# EAGLE design LM13700 (EAGLE 9.3.2)
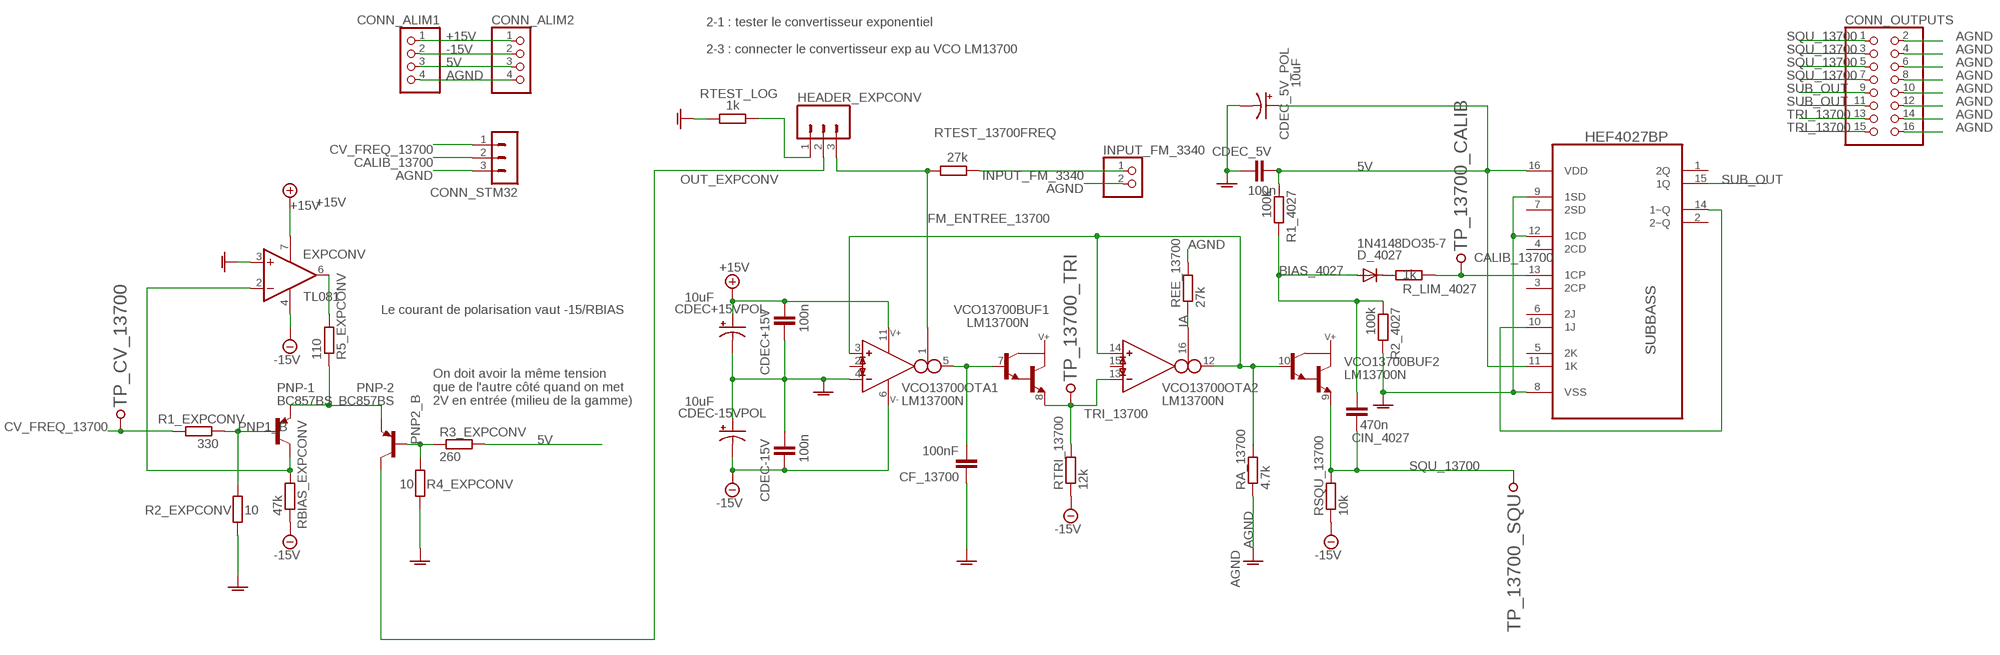
[diagram p0: schematic, sheet 1]

## Parts
CDEC+15V  100n  C-EU025-024X044  [C025-024X044]
CDEC+15VPOL  10uF  10UF-POLAR-RADIAL-2.5MM-KIT-25V-20%  [CPOL-RADIAL-2.5MM-5MM-KIT]
CDEC-15V  100n  C-EU025-024X044  [C025-024X044]
CDEC-15VPOL  10uF  10UF-POLAR-RADIAL-2.5MM-KIT-25V-20%  [CPOL-RADIAL-2.5MM-5MM-KIT]
CDEC_5V  100n  C-EU025-024X044  [C025-024X044]
CDEC_5V_POL  10uF  10UF-POLAR-RADIAL-2.5MM-KIT-25V-20%  [CPOL-RADIAL-2.5MM-5MM-KIT]
CF_13700  100nF  C-EU025-024X044  [C025-024X044]
CIN_4027  470n  C-EU050-024X044  [C050-024X044]
CONN_ALIM1  PINHD-1X4  [1X04]
CONN_ALIM2  PINHD-1X4  [1X04]
CONN_OUTPUTS  PINHD-2X8  [2X08]
CONN_STM32  MA03-1  [MA03-1]
D_4027  1N4148DO35-7  [DO35-7]
EXPCONV  TL081  1AMP_P7+4N  [DIL08]
HEADER_EXPCONV  M03  [03P]
INPUT_FM_3340  PINHD-1X2  [1X02]
PNP  BC857BS  [SOT363]
R1_4027  100k  R-EU_0204/5  [0204/5]
R1_EXPCONV  330  R-EU_0204/5  [0204/5]
R2_4027  100k  R-EU_0204/5  [0204/5]
R2_EXPCONV  10  R-EU_0204/5  [0204/5]
R3_EXPCONV  260  R-EU_0204/5  [0204/5]
R4_EXPCONV  10  R-EU_0204/5  [0204/5]
R5_EXPCONV  110  R-EU_0204/5  [0204/5]
R_LIM_4027  1k  R-EU_0204/5  [0204/5]
RA_13700  4.7k  R-EU_0204/5  [0204/5]
RBIAS_EXPCONV  47k  R-EU_0204/5  [0204/5]
REE_13700  27k  R-EU_0204/5  [0204/5]
RSQU_13700  10k  R-EU_0204/5  [0204/5]
RTEST_13700FREQ  27k  R-EU_0204/5  [0204/5]
RTEST_LOG  1k  R-EU_0204/5  [0204/5]
RTRI_13700  12k  R-EU_0204/5  [0204/5]
SUBBASS  HEF4027BP  [DIP254P762X420-16]
TP_13700_CALIB  TESTPOINT  [TESTPOINT_63]
TP_13700_SQU  TESTPOINT  [TESTPOINT_63]
TP_13700_TRI  TESTPOINT  [TESTPOINT_63]
TP_CV_13700  TESTPOINT  [TESTPOINT_63]
VCO13700  LM13700N  [DIL16]

## Nets
5V: CDEC_5V.1 CDEC_5V_POL.1(+) CONN_ALIM1.3 CONN_ALIM2.3 R1_4027.1 R3_EXPCONV.2 SUBBASS.11(1K) SUBBASS.16(VDD)
+15V: CDEC+15V.1 CDEC+15VPOL.1(+) CONN_ALIM1.1 CONN_ALIM2.1 EXPCONV.7(V+) VCO13700.11(SUPPLY:V+)
-15V: CDEC-15V.2 CDEC-15VPOL.2(-) CONN_ALIM1.2 CONN_ALIM2.2 EXPCONV.4(V-) RBIAS_EXPCONV.1 RSQU_13700.1 RTRI_13700.1 VCO13700.6(SUPPLY:V-)
AGND: CDEC+15V.2 CDEC+15VPOL.2(-) CDEC-15V.1 CDEC-15VPOL.1(+) CDEC_5V.2 CDEC_5V_POL.2(-) CF_13700.1 CONN_ALIM1.4 CONN_ALIM2.4 CONN_OUTPUTS.2 CONN_OUTPUTS.4 CONN_OUTPUTS.6 CONN_OUTPUTS.8 CONN_OUTPUTS.10 CONN_OUTPUTS.12 CONN_OUTPUTS.14 CONN_OUTPUTS.16 CONN_STM32.3 EXPCONV.3(+IN) INPUT_FM_3340.2 R2_4027.2 R2_EXPCONV.2 R4_EXPCONV.2 RA_13700.1 REE_13700.2 RTEST_LOG.2 SUBBASS.8(VSS) SUBBASS.9(1SD) SUBBASS.12(1CD) VCO13700.4(OTA1:IN_N)
BIAS_4027: CIN_4027.1 D_4027.A R1_4027.2 R2_4027.1
CALIB_13700: CONN_STM32.2 R_LIM_4027.1 SUBBASS.13(1CP) TP_13700_CALIB.P$1
CV_FREQ_13700: CONN_STM32.1 R1_EXPCONV.2 TP_CV_13700.P$1
FM_ENTREE_13700: HEADER_EXPCONV.3 RTEST_13700FREQ.2 VCO13700.1(OTA1:I_BIAS)
IA: REE_13700.1 VCO13700.16(OTA2:I_BIAS)
INPUT_FM_3340: INPUT_FM_3340.1 RTEST_13700FREQ.1
N$3: SUBBASS.10(1J) SUBBASS.14(1~Q)
N$47: D_4027.C R_LIM_4027.2
N$52: EXPCONV.6(OUT) R5_EXPCONV.2
N$63: RA_13700.2 VCO13700.3(OTA1:IN_P) VCO13700.10(BUF2:B) VCO13700.12(OTA2:OUT) VCO13700.14(OTA2:IN_P)
N$64: CF_13700.2 VCO13700.5(OTA1:OUT) VCO13700.7(BUF1:B)
N$94: HEADER_EXPCONV.1 RTEST_LOG.1
OUT_EXPCONV: HEADER_EXPCONV.2 PNP.3(-2:C)
PNP1_B: PNP.2(-1:B) R1_EXPCONV.1 R2_EXPCONV.1
PNP1_C: EXPCONV.2(-IN) PNP.6(-1:C) RBIAS_EXPCONV.2
PNP2_B: PNP.5(-2:B) R3_EXPCONV.1 R4_EXPCONV.1
PNP_E: PNP.1(-1:E) PNP.4(-2:E) R5_EXPCONV.1
SQU_13700: CIN_4027.2 CONN_OUTPUTS.1 CONN_OUTPUTS.3 CONN_OUTPUTS.5 CONN_OUTPUTS.7 RSQU_13700.2 TP_13700_SQU.P$1 VCO13700.9(BUF2:E)
SUB_OUT: CONN_OUTPUTS.9 CONN_OUTPUTS.11 SUBBASS.15(1Q)
TRI_13700: CONN_OUTPUTS.13 CONN_OUTPUTS.15 RTRI_13700.2 TP_13700_TRI.P$1 VCO13700.8(BUF1:E) VCO13700.13(OTA2:IN_N)
Unconnected: SUBBASS.1(2Q) SUBBASS.2(2~Q) SUBBASS.3(2CP) SUBBASS.4(2CD) SUBBASS.5(2K) SUBBASS.6(2J) SUBBASS.7(2SD) VCO13700.2(OTA1:I_DIODE) VCO13700.15(OTA2:I_DIODE)

## Notes on the sheet
- 2-1 : tester le convertisseur exponentiel
  
  2-3 : connecter le convertisseur exp au VCO LM13700
- Le courant de polarisation vaut -15/RBIAS
- On doit avoir la même tension 
  que de l'autre côté quand on met
  2V en entrée (milieu de la gamme)

## Library data of the parts
CDEC+15V CDEC-15V CDEC_5V CF_13700 CIN_4027 = rcl:C-EU: CAPACITOR, European symbol; SPICEPREFIX: C
CDEC+15VPOL CDEC-15VPOL CDEC_5V_POL = SparkFun-Capacitors:10UF-POLAR: 10.0µF polarized capacitors A capacitor is a passive two-terminal electrical component used to store electrical energy temporarily in an electric field.; PROD_ID: CAP-08440
CONN_ALIM1 CONN_ALIM2 = pinhead:PINHD-1X4: PIN HEADER
CONN_OUTPUTS = pinhead:PINHD-2X8: PIN HEADER
CONN_STM32 = con-lstb:MA03-1: PIN HEADER; OC_FARNELL: unknown; OC_NEWARK: unknown
D_4027 = diode:1N4148: DIODE high speed (Philips)
EXPCONV = linear:1AMP_P7+4: OP AMP
HEADER_EXPCONV = con-amp-quick:M03: AMP QUICK CONNECTOR; OC_FARNELL: unknown; OC_NEWARK: unknown
INPUT_FM_3340 = pinhead:PINHD-1X2: PIN HEADER
PNP = nxp_60:BC857BS: PNP double transistor in an SC-88; SOT363 plastic package. AAL Eindhoven MK
R1_4027 R1_EXPCONV R2_4027 R2_EXPCONV R3_EXPCONV R4_EXPCONV R5_EXPCONV R_LIM_4027 RA_13700 RBIAS_EXPCONV REE_13700 RSQU_13700 RTEST_13700FREQ RTEST_LOG RTRI_13700 = rcl:R-EU_: RESISTOR, European symbol; SPICEPREFIX: R
SUBBASS = HEF4027BP:HEF4027BP: Dual JK flip-flop; AVAILABILITY: Unavailable; DESCRIPTION: Dual J-K flip-flop w/set&reset HEF4027BP; MF: NXP Semiconductors; MP: HEF4027BP; PACKAGE: DIP-16 NXP Semiconductors; PRICE: None
TP_13700_CALIB TP_13700_SQU TP_13700_TRI TP_CV_13700 = 6P1_EVB:TESTPOINT
VCO13700 = ota:LM13700: Dual OTA with buffers

## Board
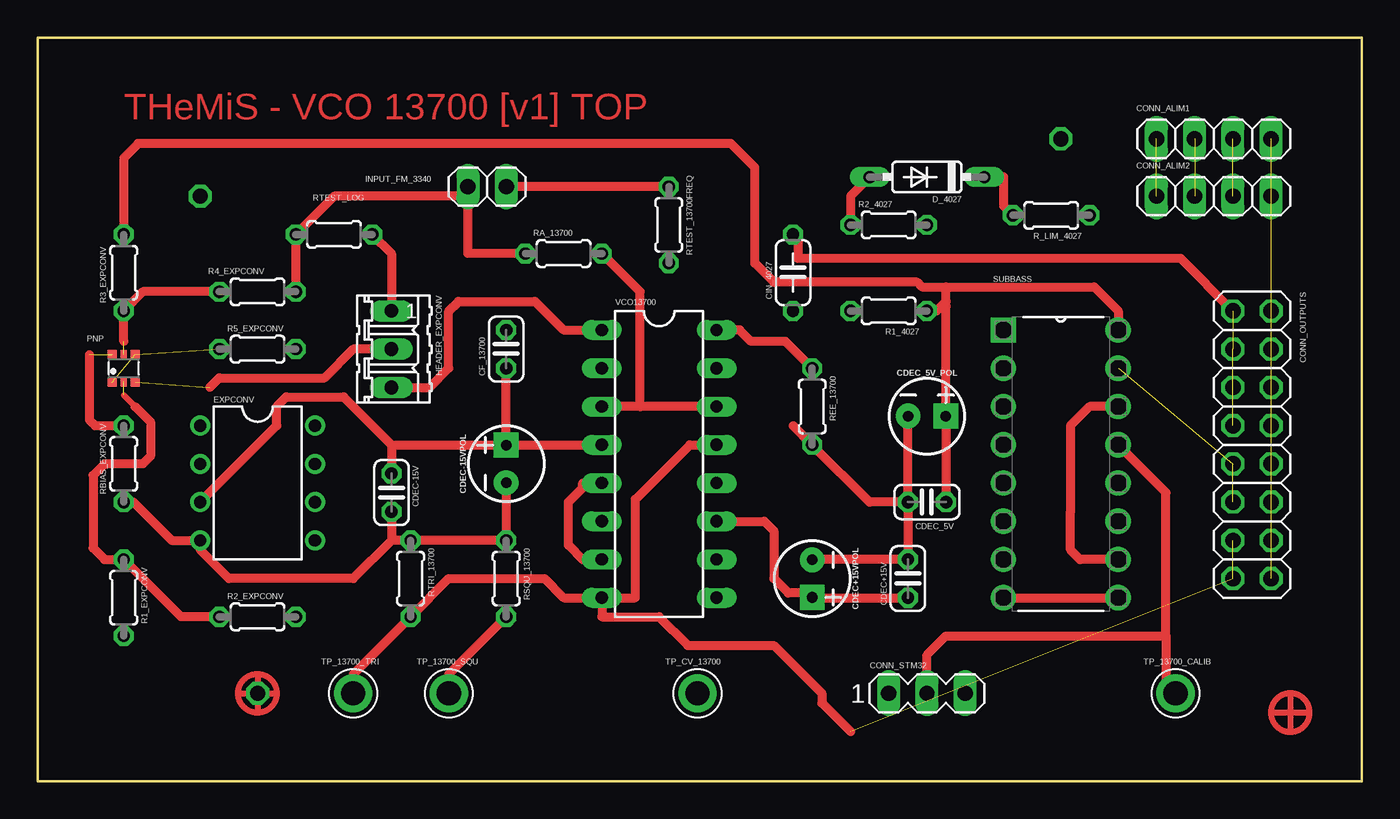
[diagram p1: board, top side]
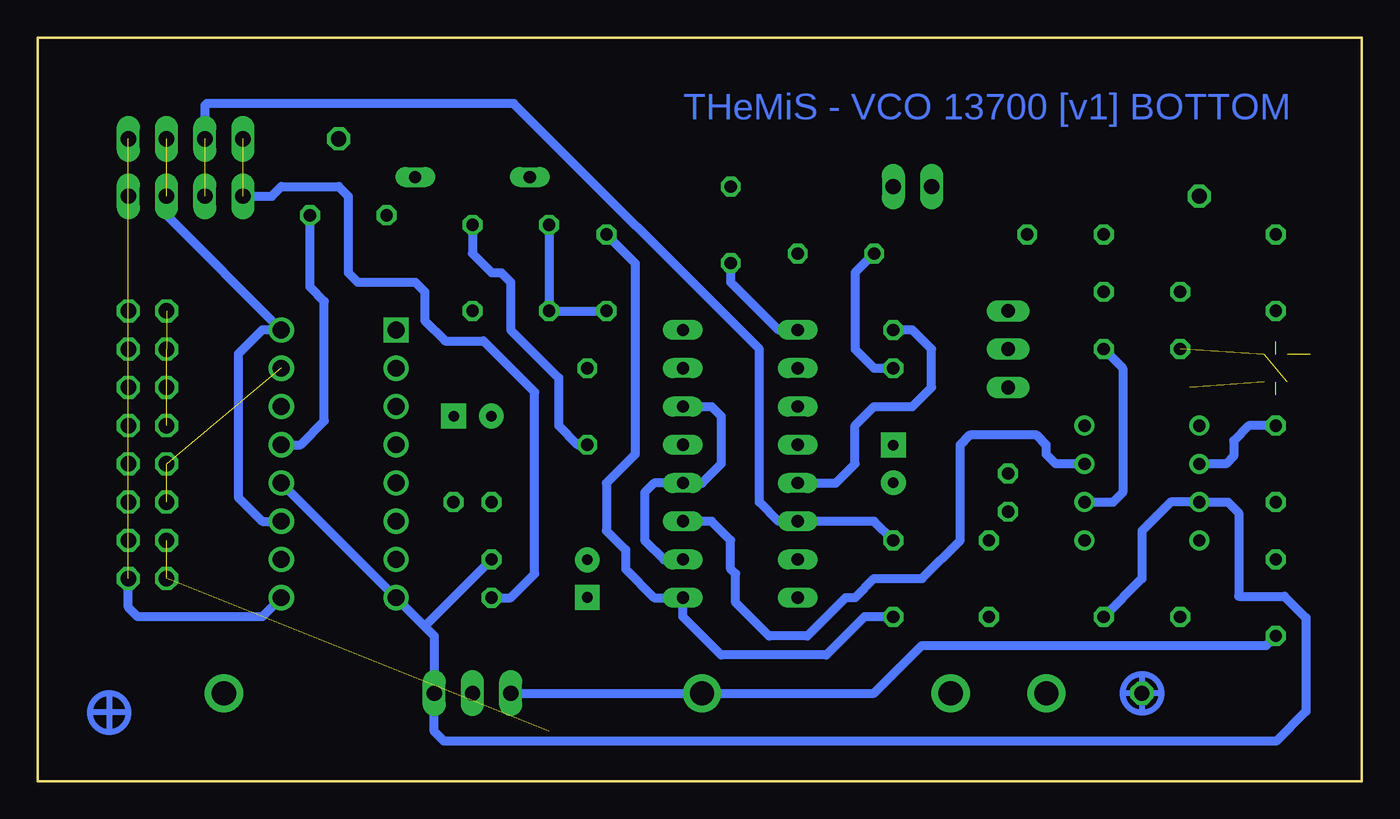
[diagram p2: board, bottom side, seen from below]

Size 87.93 x 49.39 mm. Coordinates in mm from the lower left corner, seen from the top.
Outline: 0,0 87.93,0 87.93,49.39 0,49.39 0,0
Copper layers (1*16): Top 0.035mm / dielectric 1.5mm / Bottom 0.035mm
Design rules "default *": minimum track width 0.4mm, minimum drill 0.35mm, track to track 0.4mm, track to pad 0.4mm, pad to pad 0.4mm, via to via 0.4mm, smd to smd 0.4mm, copper to edge 40mil, drill to drill 6mil, minimum pad ring 10mil, minimum via ring 8mil, stop-mask expansion 4mil, vias tented up to drill 0mil, thermal gap 10mil

### Footprints (pad centres in the part's own frame; a part is rotated, then mirrored left to right if it is on the bottom)
C025-024X044 = drill 0.813 octagon: 1 -1.27,0; 2 1.27,0
CPOL-RADIAL-2.5MM-5MM-KIT = drill 0.7 pad 1.651 square: 1 1.25,0 | drill 0.7 pad 1.651: 2 -1.25,0
C050-024X044 = drill 0.813 octagon: 1 -2.54,0; 2 2.54,0
1X04 = drill 1.016 long: 1 -3.81,0; 2 -1.27,0; 3 1.27,0; 4 3.81,0
2X08 = drill 1.016 octagon: 1 -8.89,-1.27; 2 -8.89,1.27; 3 -6.35,-1.27; 4 -6.35,1.27; 5 -3.81,-1.27; 6 -3.81,1.27; 7 -1.27,-1.27; 8 -1.27,1.27; 9 1.27,-1.27; 10 1.27,1.27; 11 3.81,-1.27; 12 3.81,1.27; 13 6.35,-1.27; 14 6.35,1.27; 15 8.89,-1.27; 16 8.89,1.27
MA03-1 = drill 1.016 long: 1 -2.54,0; 2 0,0; 3 2.54,0
DO35-7 = drill 0.813 long: A 3.81,0; C -3.81,0
DIL08 = drill 0.813 pad 1.27: 1 -3.81,-3.81; 2 -1.27,-3.81; 3 1.27,-3.81; 4 3.81,-3.81; 5 3.81,3.81; 6 1.27,3.81; 7 -1.27,3.81; 8 -3.81,3.81
03P = drill 0.914 long: 1 -2.54,0; 2 0,0; 3 2.54,0
1X02 = drill 1.016 long: 1 -1.27,0; 2 1.27,0
SOT363 = smd 0.6 x 0.6: 1 -0.75,-0.9; 3 0.75,-0.9; 4 0.75,0.9; 6 -0.75,0.9 | smd 0.4 x 0.6: 2 0,-0.9; 5 0,0.9
0204/5 = drill 0.813 octagon: 1 -2.54,0; 2 2.54,0
DIP254P762X420-16 = drill 1.118 square: 1 -7.62,17.78 | drill 1.118: 2 -7.62,15.24; 3 -7.62,12.7; 4 -7.62,10.16; 5 -7.62,7.62; 6 -7.62,5.08; 7 -7.62,2.54; 8 -7.62,0; 9 0,0; 10 0,2.54; 11 0,5.08; 12 0,7.62; 13 0,10.16; 14 0,12.7; 15 0,15.24; 16 0,17.78
TESTPOINT_63 = drill 1.6 pad 2.54: P$1 0,0
DIL16 = drill 0.813 long: 1 -8.89,-3.81; 2 -6.35,-3.81; 3 -3.81,-3.81; 4 -1.27,-3.81; 5 1.27,-3.81; 6 3.81,-3.81; 7 6.35,-3.81; 8 8.89,-3.81; 9 8.89,3.81; 10 6.35,3.81; 11 3.81,3.81; 12 1.27,3.81; 13 -1.27,3.81; 14 -3.81,3.81; 15 -6.35,3.81; 16 -8.89,3.81

### Placement (x,y rotation side)
CDEC+15V  57.79,13.46 90 top
CDEC+15VPOL  51.44,13.46 270 top
CDEC-15V  23.49,19.18 270 top
CDEC-15VPOL  31.11,21.08 90 top
CDEC_5V  59.05,18.54 180 top
CDEC_5V_POL  59.05,24.26 0 top
CF_13700  31.11,28.7 90 top
CIN_4027  50.16,33.78 90 top
CONN_ALIM1  78.1,42.67 0 top
CONN_ALIM2  78.1,38.86 0 top
CONN_OUTPUTS  80.64,22.35 270 top
CONN_STM32  59.05,5.84 0 top
D_4027  59.05,40.13 180 top
EXPCONV  14.61,19.81 270 top
HEADER_EXPCONV  23.49,28.7 270 top
INPUT_FM_3340  29.84,39.5 180 top
PNP  5.71,27.43 0 top
R1_4027  56.52,31.24 180 top
R1_EXPCONV  5.71,12.19 270 top
R2_4027  56.52,36.96 0 top
R2_EXPCONV  14.61,10.92 0 top
R3_EXPCONV  5.71,33.78 90 top
R4_EXPCONV  14.61,32.51 0 top
R5_EXPCONV  14.61,28.7 0 top
R_LIM_4027  67.31,37.59 180 top
RA_13700  34.93,35.05 0 top
RBIAS_EXPCONV  5.71,21.08 90 top
REE_13700  51.44,24.89 270 top
RSQU_13700  31.11,13.46 270 top
RTEST_13700FREQ  41.91,36.96 270 top
RTEST_LOG  19.68,36.32 180 top
RTRI_13700  24.76,13.46 270 top
SUBBASS  71.75,12.19 0 top
TP_13700_CALIB  75.56,5.84 0 top
TP_13700_SQU  27.3,5.84 0 top
TP_13700_TRI  20.95,5.84 0 top
TP_CV_13700  43.82,5.84 0 top
VCO13700  41.27,21.08 270 top

### Tracks (layer width: path | path; a pad name or v marks a point on that pad's centre or on a via)
5V  (1 unrouted)
  Top 0.61: CDEC_5V.1 60.33,24.26 CDEC_5V_POL.1 60.33,24.28 60.33,31.56 60.01,31.56 | R3_EXPCONV.2 5.71,41.4 6.67,42.36 46.04,42.36 47.62,40.77 47.62,34.42 48.9,33.15 58.42,33.15 58.74,32.83 60.33,32.83 | SUBBASS.16 71.75,31.24 70.17,32.83 60.33,32.83 | 60.01,31.56 59.69,31.24 R1_4027.1 | 60.01,31.56 60.33,31.88 60.33,32.83
  Bottom 0.61: SUBBASS.11 73.02,17.27 74.61,18.86 74.61,28.38 73.02,29.97 SUBBASS.16 79.38,37.59 CONN_ALIM2.3
+15V  (1 unrouted)
  Top 0.61: CDEC+15V.1 51.44,12.19 CDEC+15VPOL.1 51.44,12.51 49.85,12.51 48.9,13.46 48.9,16.64 48.26,17.27 VCO13700.11
  Bottom 0.61: CDEC+15V.1 56.52,12.19 54.93,13.78 54.93,25.84 58.33,29.24 60.89,29.24 60.89,29.27 62.23,30.61 62.23,32.51 62.87,33.15 66.67,33.15 67.31,33.78 67.31,38.86 67.94,39.5 71.75,39.5 72.39,38.86 CONN_ALIM2.1 | VCO13700.11 43.18,17.27 41.91,16 41.91,14.1 41.59,13.78 41.59,11.88 39.37,9.65 36.83,9.65 34.29,12.19 33.66,12.19 32.39,13.46 29.21,13.46 26.67,16 26.67,22.35 26.04,22.99 21.59,22.99 20.95,22.35 20.95,21.72 20.32,21.08 EXPCONV.7
-15V  (1 unrouted)
  Top 0.61: RBIAS_EXPCONV.1 6.35,18.54 8.89,16 EXPCONV.4 10.79,15.37 12.7,13.46 20.95,13.46 23.49,16 | CDEC-15V.2 23.49,16 | CDEC-15VPOL.2 RSQU_13700.1 RTRI_13700.1 23.49,16
  Bottom 0.61: RSQU_13700.1 32.39,17.27 VCO13700.6 38.73,17.27 40.01,18.54 40.01,28.7 56.32,45.02 76.71,45.02 76.83,44.9 CONN_ALIM1.2
AGND  (9 unrouted)
  Top 0.61: R4_EXPCONV.2 RTEST_LOG.2 19.68,38.86 28.57,38.86 | 31.11,22.35 VCO13700.4 | 31.11,22.35 CF_13700.1 | 28.57,38.86 28.57,35.05 RA_13700.1 | 28.57,38.86 INPUT_FM_3340.2 | 31.11,22.35 CDEC-15VPOL.1 23.51,22.33 23.49,22.35 | SUBBASS.8 SUBBASS.9 | CDEC_5V.2 55.25,18.54 REE_13700.2 50.16,23.62 | CDEC_5V.2 CDEC+15V.2 51.44,14.73 CDEC+15VPOL.2 | CDEC_5V.2 57.79,24.26 CDEC_5V_POL.2 | 23.49,22.35 CDEC-15V.1 | 23.49,22.35 20.32,25.53 16.51,25.53 15.88,24.89 15.88,23.62 EXPCONV.3
  Bottom 0.61: R2_EXPCONV.2 14.61,13.46 14.61,16.64 12.7,18.54 EXPCONV.3 8.89,18.54 8.19,17.84 8.19,12.29 5.15,12.29 3.71,10.85 3.71,4.64 5.69,2.67 60.96,2.67 61.59,3.3 CONN_STM32.3 61.59,9.65 62.23,10.29 | 62.23,10.29 SUBBASS.8 SUBBASS.12 | R2_4027.2 59.05,35.05 57.79,33.78 57.15,33.78 56.52,33.15 56.52,29.97 53.34,26.8 53.34,23.62 52.07,22.35 REE_13700.2 | CDEC+15V.2 62.23,10.29 | CONN_OUTPUTS.16 81.91,11.56 81.28,10.92 73.02,10.92 SUBBASS.9 | RA_13700.1 33.66,33.78 33.66,28.7 32.39,27.43 CF_13700.1
BIAS_4027
  Top 0.61: D_4027.A 53.98,38.86 R2_4027.1
  Bottom 0.61: R2_4027.1 R1_4027.2 CIN_4027.1
CALIB_13700
  Top 0.61: SUBBASS.13 74.93,19.18 74.93,9.65 | CONN_STM32.2 59.05,8.38 60.33,9.65 74.93,9.65 | 74.93,9.65 74.93,6.48 TP_13700_CALIB.P$1
  Bottom 0.61: R_LIM_4027.1 69.85,32.83 68.9,31.88 68.9,23.94 70.48,22.35 SUBBASS.13
CV_FREQ_13700
  Bottom 0.61: R1_EXPCONV.2 6.35,9.02 29.21,9.02 32.39,5.84 TP_CV_13700.P$1 CONN_STM32.1
FM_ENTREE_13700
  Top 0.61: VCO13700.1 34.93,29.97 33.02,31.88 27.94,31.88 27.3,31.24 27.3,27.43 26.04,26.16 HEADER_EXPCONV.3
  Bottom 0.61: VCO13700.1 38.73,29.97 41.91,33.15 RTEST_13700FREQ.2
IA
  Top 0.61: VCO13700.16 46.61,29.97 47.37,29.21 49.66,29.21 REE_13700.1
INPUT_FM_3340
  Top 0.61: RTEST_13700FREQ.1 INPUT_FM_3340.1
N$3
  Top 0.61: SUBBASS.14 69.85,24.89 68.58,23.62 68.58,18.54 68.58,17.91 68.58,15.37 69.21,14.73 SUBBASS.10
N$6
  Top 0.406: 83.18,5.84 83.18,3.3
N$7
  Top 0.406: 81.91,4.57 84.45,4.57
N$8
  Bottom 0.406: 81.91,4.57 84.45,4.57
N$9
  Bottom 0.406: 83.18,5.84 83.18,3.3
N$10
  Top 0.406: 14.61,7.11 14.61,4.57
N$11
  Top 0.406: 13.34,5.84 15.88,5.84
N$12
  Bottom 0.406: 13.34,5.84 15.88,5.84
N$13
  Bottom 0.406: 14.61,7.11 14.61,4.57
N$14  (via drill 1.02)
  other vias: 67.94,42.67 10.79,38.86 14.61,5.84
N$47
  Top 0.61: R_LIM_4027.2 64.13,38.23 64.13,40.13 D_4027.C
N$52
  Bottom 0.61: EXPCONV.6 16.51,18.54 15.88,19.18 15.88,27.43 R5_EXPCONV.2
N$63
  Top 0.61: VCO13700.14 40.01,24.89 | 40.01,24.89 VCO13700.3 | RA_13700.2 40.01,32.51 40.01,24.89
  Bottom 0.61: VCO13700.10 46.36,14.73 47.62,16 47.62,19.18 46.99,19.81 VCO13700.12 43.82,19.81 42.55,21.08 42.55,24.26 43.18,24.89 VCO13700.14
N$64
  Top 0.61: VCO13700.5 36.2,19.81 36.2,19.5 35.24,18.54 35.24,15.68 36.2,14.73 VCO13700.7
  Bottom 0.61: 36.83,19.81 VCO13700.5 34.93,19.81 33.66,21.08 33.66,23.62 32.39,24.89 29.84,24.89 28.57,26.16 28.57,28.7 29.84,29.97 CF_13700.2
N$94
  Top 0.61: RTEST_LOG.1 23.49,35.05 HEADER_EXPCONV.1
OUT_EXPCONV  (1 unrouted)
  Top 0.61: HEADER_EXPCONV.2 20.95,28.7 19.05,26.8 12.06,26.8 11.43,26.16
PNP1_B  (1 unrouted)
  Top 0.406: 5.71,25.65 6.48,24.89
  Top 0.61: R2_EXPCONV.1 9.53,10.92 R1_EXPCONV.1 4.45,14.73 3.68,15.49 3.68,20.32 4.45,21.08 6.99,21.08 7.49,21.59 7.49,23.88 6.48,24.89
PNP1_C  (1 unrouted)
  Top 0.61: RBIAS_EXPCONV.2 3.81,23.62 3.43,24 3.43,28.32 3.44,28.33
  Bottom 0.61: RBIAS_EXPCONV.2 7.49,23.62 8.51,22.61 8.51,21.59 9.02,21.08 EXPCONV.2
PNP2_B  (1 unrouted)
  Top 0.61: R4_EXPCONV.1 6.99,32.51 R3_EXPCONV.1 5.71,29.21
PNP_E  (2 unrouted)
SQU_13700  (3 unrouted)
  Top 0.61: RSQU_13700.2 27.3,7.11 TP_13700_SQU.P$1 | CONN_OUTPUTS.1 75.88,34.73 50.48,34.73 50.48,36 CIN_4027.2
  Bottom 0.61: CIN_4027.2 48.26,34.42 48.26,21.72 50.16,19.81 50.16,16.64 48.9,15.37 48.9,14.1 46.99,12.19 VCO13700.9 45.09,10.92 42.55,8.38 35.56,8.38 33.02,10.92 RSQU_13700.2
SUB_OUT  (2 unrouted)
TRI_13700  (2 unrouted)
  Top 0.61: TP_13700_TRI.P$1 20.95,7.11 RTRI_13700.2 27.3,13.46 33.66,13.46 34.93,12.19 VCO13700.8 | VCO13700.13 43.31,22.35 39.69,18.73 39.69,12.19 VCO13700.8 | VCO13700.8 37.47,10.92 41.27,10.92 43.18,9.02 48.9,9.02 52.07,5.84 52.07,5.21 53.98,3.3
(copper drawn outside any net)
  shapes: Bottom circle x2, Top circle x2

### Text on the board
Top: THeMiS - VCO 13700 [v1] TOP
Bottom: THeMiS - VCO 13700 [v1] BOTTOM